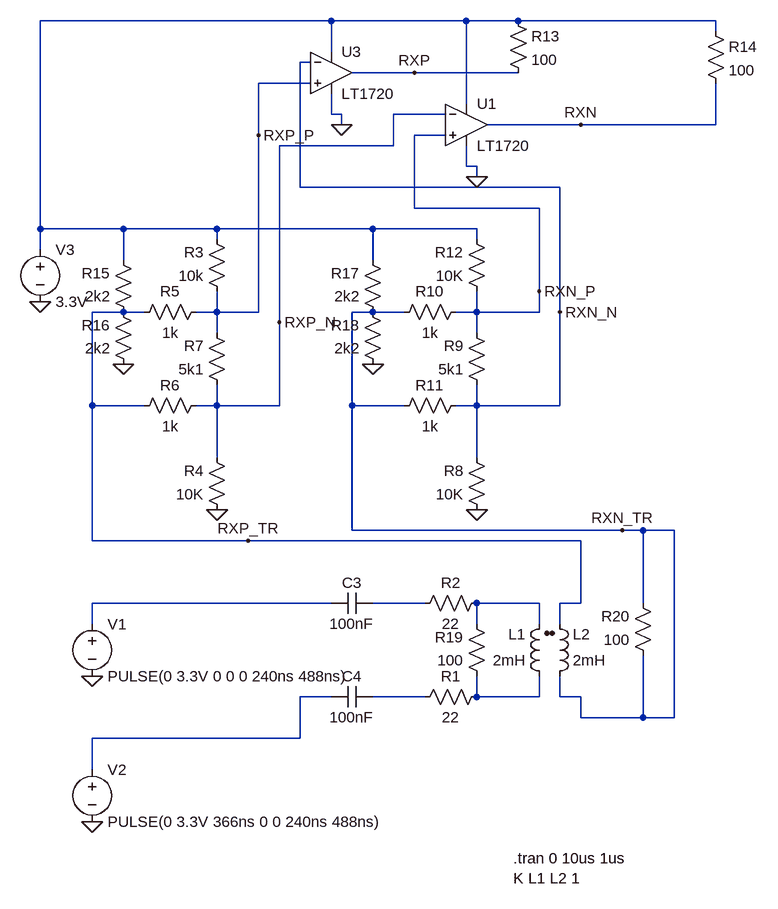
[diagram p0: schematic e1_t1_interface.asc]
e1_t1_interface.asc, the LTspice schematic file:
Version 4
SHEET 1 2132 680
WIRE 464 -672 16 -672
WIRE 672 -672 464 -672
WIRE 752 -672 672 -672
WIRE 1056 -672 752 -672
WIRE 1056 -656 1056 -672
WIRE 464 -624 464 -672
WIRE 432 -608 416 -608
WIRE 592 -592 496 -592
WIRE 752 -592 592 -592
WIRE 432 -576 352 -576
WIRE 672 -544 672 -672
WIRE 464 -528 464 -560
WIRE 480 -528 464 -528
WIRE 640 -528 560 -528
WIRE 480 -512 480 -528
WIRE 848 -512 704 -512
WIRE 1056 -512 1056 -576
WIRE 1056 -512 848 -512
WIRE 352 -496 352 -576
WIRE 640 -496 592 -496
WIRE 560 -480 560 -528
WIRE 560 -480 384 -480
WIRE 672 -448 672 -480
WIRE 688 -448 672 -448
WIRE 688 -432 688 -448
WIRE 416 -416 416 -608
WIRE 816 -416 416 -416
WIRE 592 -384 592 -496
WIRE 784 -384 592 -384
WIRE 16 -352 16 -672
WIRE 144 -352 16 -352
WIRE 288 -352 144 -352
WIRE 528 -352 288 -352
WIRE 688 -352 528 -352
WIRE 288 -336 288 -352
WIRE 688 -336 688 -352
WIRE 16 -320 16 -352
WIRE 144 -304 144 -352
WIRE 528 -304 528 -352
WIRE 784 -256 784 -384
WIRE 144 -224 96 -224
WIRE 176 -224 144 -224
WIRE 288 -224 288 -256
WIRE 288 -224 256 -224
WIRE 352 -224 352 -496
WIRE 352 -224 288 -224
WIRE 528 -224 496 -224
WIRE 576 -224 528 -224
WIRE 688 -224 688 -256
WIRE 688 -224 656 -224
WIRE 784 -224 784 -256
WIRE 784 -224 688 -224
WIRE 816 -224 816 -416
WIRE 384 -208 384 -480
WIRE 288 -192 288 -224
WIRE 688 -192 688 -224
WIRE 96 -80 96 -224
WIRE 176 -80 96 -80
WIRE 288 -80 288 -112
WIRE 288 -80 256 -80
WIRE 384 -80 384 -208
WIRE 384 -80 288 -80
WIRE 496 -80 496 -224
WIRE 576 -80 496 -80
WIRE 688 -80 688 -112
WIRE 688 -80 656 -80
WIRE 816 -80 816 -224
WIRE 816 -80 688 -80
WIRE 288 0 288 -80
WIRE 688 0 688 -80
WIRE 496 112 496 -80
WIRE 912 112 496 112
WIRE 944 112 912 112
WIRE 992 112 944 112
WIRE 96 128 96 -80
WIRE 336 128 96 128
WIRE 848 128 336 128
WIRE 464 224 96 224
WIRE 608 224 528 224
WIRE 784 224 688 224
WIRE 848 224 848 128
WIRE 848 224 816 224
WIRE 944 224 944 112
WIRE 96 256 96 224
WIRE 688 256 688 224
WIRE 784 256 784 224
WIRE 816 256 816 224
WIRE 464 368 416 368
WIRE 608 368 528 368
WIRE 688 368 688 336
WIRE 784 368 784 336
WIRE 784 368 688 368
WIRE 816 368 816 336
WIRE 848 368 816 368
WIRE 848 400 848 368
WIRE 944 400 944 304
WIRE 944 400 848 400
WIRE 992 400 992 112
WIRE 992 400 944 400
WIRE 416 432 416 368
WIRE 416 432 96 432
WIRE 96 480 96 432
FLAG 96 336 0
FLAG 96 560 0
FLAG 288 80 0
FLAG 16 -240 0
FLAG 688 80 0
FLAG 480 -512 0
FLAG 688 -432 0
FLAG 144 -144 0
FLAG 528 -144 0
FLAG 848 -512 RXN
FLAG 592 -592 RXP
FLAG 336 128 RXP_TR
FLAG 912 112 RXN_TR
FLAG 352 -496 RXP_P
FLAG 384 -208 RXP_N
FLAG 784 -256 RXN_P
FLAG 816 -224 RXN_N
SYMBOL voltage 96 240 R0
SYMATTR InstName V1
SYMATTR Value PULSE(0 3.3V 0 0 0 240ns 488ns)
SYMBOL ind2 800 352 R180
WINDOW 0 36 80 Left 2
WINDOW 3 36 40 Left 2
SYMATTR InstName L1
SYMATTR Value 2mH
SYMATTR Type ind
SYMBOL ind2 800 352 M180
WINDOW 0 36 80 Left 2
WINDOW 3 36 40 Left 2
SYMATTR InstName L2
SYMATTR Value 2mH
SYMATTR Type ind
SYMBOL res 704 352 R90
WINDOW 0 0 56 VBottom 2
WINDOW 3 32 56 VTop 2
SYMATTR InstName R1
SYMATTR Value 22
SYMBOL res 704 208 R90
WINDOW 0 0 56 VBottom 2
WINDOW 3 32 56 VTop 2
SYMATTR InstName R2
SYMATTR Value 22
SYMBOL voltage 96 464 R0
SYMATTR InstName V2
SYMATTR Value PULSE(0 3.3V 366ns 0 0 240ns 488ns)
SYMBOL res 304 -240 R180
WINDOW 0 36 76 Left 2
WINDOW 3 36 40 Left 2
SYMATTR InstName R3
SYMATTR Value 10k
SYMBOL res 304 96 R180
WINDOW 0 36 76 Left 2
WINDOW 3 36 40 Left 2
SYMATTR InstName R4
SYMATTR Value 10K
SYMBOL voltage 16 -336 R0
SYMATTR InstName V3
SYMATTR Value 3.3V
SYMBOL res 304 -96 R180
WINDOW 0 36 76 Left 2
WINDOW 3 36 40 Left 2
SYMATTR InstName R7
SYMATTR Value 5k1
SYMBOL res 160 -208 R270
WINDOW 0 32 56 VTop 2
WINDOW 3 0 56 VBottom 2
SYMATTR InstName R5
SYMATTR Value 1k
SYMBOL res 160 -64 R270
WINDOW 0 32 56 VTop 2
WINDOW 3 0 56 VBottom 2
SYMATTR InstName R6
SYMATTR Value 1k
SYMBOL res 704 96 R180
WINDOW 0 36 76 Left 2
WINDOW 3 36 40 Left 2
SYMATTR InstName R8
SYMATTR Value 10K
SYMBOL res 704 -96 R180
WINDOW 0 36 76 Left 2
WINDOW 3 36 40 Left 2
SYMATTR InstName R9
SYMATTR Value 5k1
SYMBOL res 560 -208 R270
WINDOW 0 32 56 VTop 2
WINDOW 3 0 56 VBottom 2
SYMATTR InstName R10
SYMATTR Value 1k
SYMBOL res 560 -64 R270
WINDOW 0 32 56 VTop 2
WINDOW 3 0 56 VBottom 2
SYMATTR InstName R11
SYMATTR Value 1k
SYMBOL res 704 -240 R180
WINDOW 0 36 76 Left 2
WINDOW 3 36 40 Left 2
SYMATTR InstName R12
SYMATTR Value 10K
SYMBOL res 736 -688 R0
SYMATTR InstName R13
SYMATTR Value 100
SYMBOL res 1040 -672 R0
SYMATTR InstName R14
SYMATTR Value 100
SYMBOL res 160 -208 R180
WINDOW 0 36 76 Left 2
WINDOW 3 36 40 Left 2
SYMATTR InstName R15
SYMATTR Value 2k2
SYMBOL res 160 -128 R180
WINDOW 0 36 76 Left 2
WINDOW 3 36 40 Left 2
SYMATTR InstName R16
SYMATTR Value 2k2
SYMBOL res 544 -208 R180
WINDOW 0 36 76 Left 2
WINDOW 3 36 40 Left 2
SYMATTR InstName R17
SYMATTR Value 2k2
SYMBOL res 544 -128 R180
WINDOW 0 36 76 Left 2
WINDOW 3 36 40 Left 2
SYMATTR InstName R18
SYMATTR Value 2k2
SYMBOL Comparators/LT1720 464 -656 R0
SYMATTR InstName U3
SYMBOL Comparators/LT1720 672 -576 R0
SYMATTR InstName U1
SYMBOL cap 528 208 R90
WINDOW 0 0 32 VBottom 2
WINDOW 3 32 32 VTop 2
SYMATTR InstName C3
SYMATTR Value 100nF
SYMBOL cap 528 352 R90
WINDOW 0 0 32 VBottom 2
WINDOW 3 32 32 VTop 2
SYMATTR InstName C4
SYMATTR Value 100nF
SYMBOL res 704 352 R180
WINDOW 0 36 76 Left 2
WINDOW 3 36 40 Left 2
SYMATTR InstName R19
SYMATTR Value 100
SYMBOL res 960 320 R180
WINDOW 0 36 76 Left 2
WINDOW 3 36 40 Left 2
SYMATTR InstName R20
SYMATTR Value 100
TEXT 744 616 Left 2 !.tran 0 10us 1us\nK L1 L2 1

The netlist it stands for:
* e1_t1_interface.asc
V1 N002 0 PULSE(0 3.3V 0 0 0 240ns 488ns)
L1 N007 N004 2mH
L2 RXN_TR RXP_TR 2mH
R1 N007 N006 22
R2 N004 N003 22
V2 N005 0 PULSE(0 3.3V 366ns 0 0 240ns 488ns)
R3 RXP_P N001 10k
R4 0 RXP_N 10K
V3 N001 0 3.3V
R7 RXP_N RXP_P 5k1
R5 RXP_TR RXP_P 1k
R6 RXP_TR RXP_N 1k
R8 0 RXN_N 10K
R9 RXN_N RXN_P 5k1
R10 RXN_TR RXN_P 1k
R11 RXN_TR RXN_N 1k
R12 RXN_P N001 10K
R13 N001 RXP 100
R14 N001 RXN 100
R15 RXP_TR N001 2k2
R16 0 RXP_TR 2k2
R17 RXN_TR N001 2k2
R18 0 RXN_TR 2k2
XU3 RXP_P RXN_N N001 0 RXP LT1720  ; pins In+ In- V+ V- OUT
XU1 RXN_P RXP_N N001 0 RXN LT1720  ; pins In+ In- V+ V- OUT
C3 N003 N002 100nF
C4 N006 N005 100nF
R19 N007 N004 100
R20 RXN_TR RXN_TR 100
.tran 0 10us 1us
K L1 L2 1
.lib LT1720.sub
.backanno
.end